# EAGLE schematic schetamic (EAGLE 6.3)
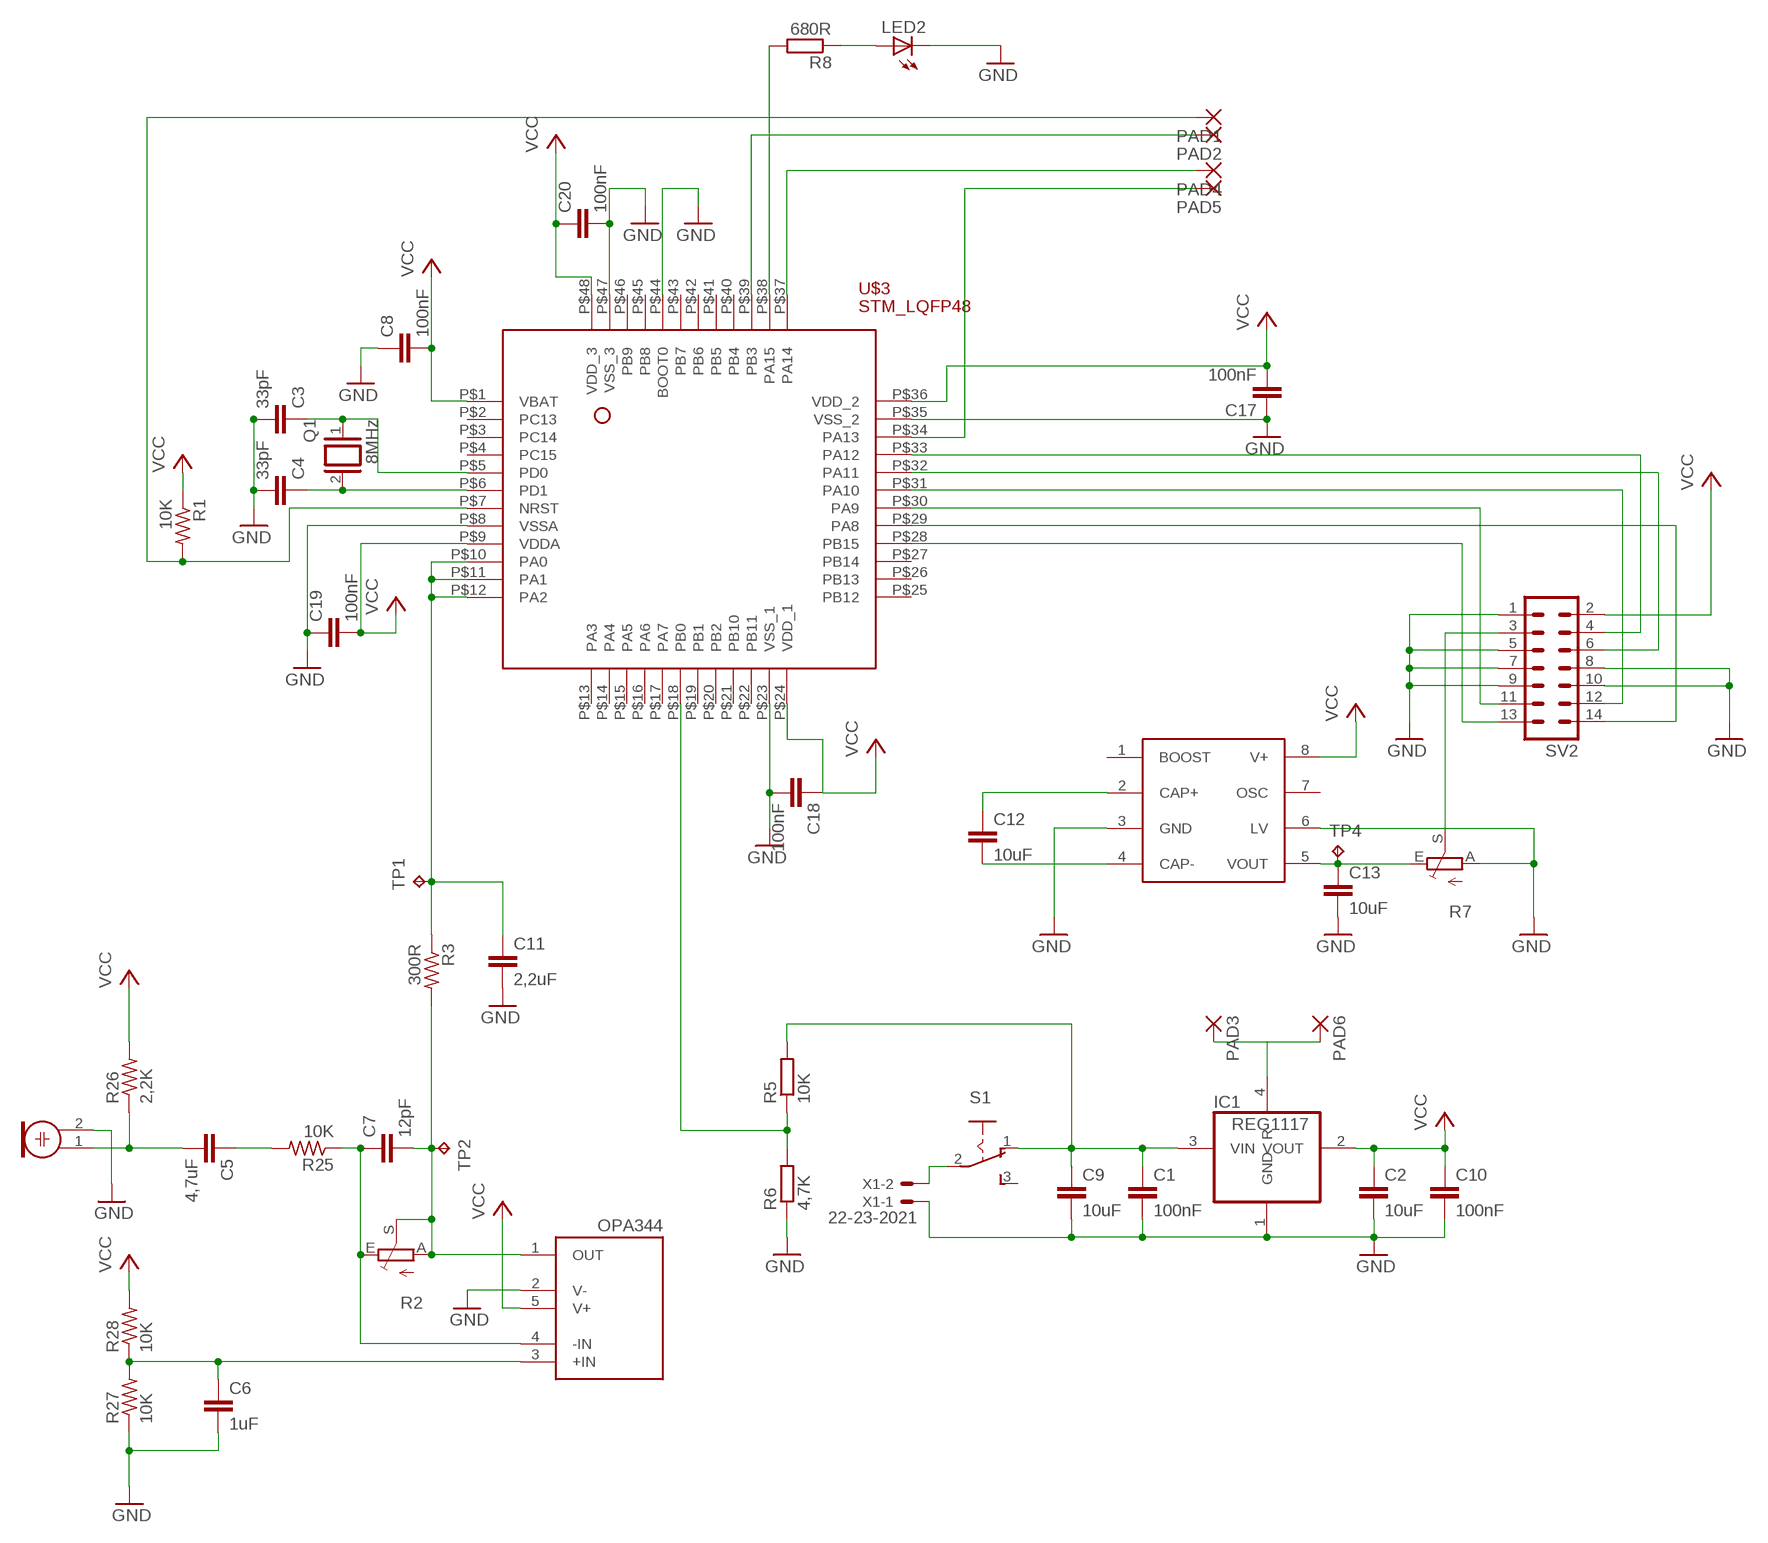
[diagram p0: schematic, sheet 1]

## Parts
C1  100nF  C-EUC1206K  [C1206K]
C2  10uF  C-EUC0805  [C0805]
C3  33pF  C-EUC0805  [C0805]
C4  33pF  C-EUC0805  [C0805]
C5  4,7uF  C-EUC0805  [C0805]
C6  1uF  C-EUC1210  [C1210]
C7  12pF  C-EUC0805  [C0805]
C8  100nF  C-EUC1206K  [C1206K]
C9  10uF  C-EUC0805  [C0805]
C10  100nF  C-EUC1206K  [C1206K]
C11  2,2uF  C-EUC1206K  [C1206K]
C12  10uF  C-EUC0805  [C0805]
C13  10uF  C-EUC0805  [C0805]
C17  100nF  C-EUC1206K  [C1206K]
C18  100nF  C-EUC1206K  [C1206K]
C19  100nF  C-EUC1206K  [C1206K]
C20  100nF  C-EUC1206K  [C1206K]
IC1  REG1117  [SOT223]
LED2  LED3MM  [LED3MM]
M1  ELECTRET_MICROPHON-F6050AP  [F6050AP]
PAD1  SMD2  [SMD1,27-2,54]
PAD2  SMD2  [SMD1,27-2,54]
PAD3  1,6/0,8  [1,6/0,8]
PAD4  SMD2  [SMD1,27-2,54]
PAD5  SMD2  [SMD1,27-2,54]
PAD6  1,6/0,8  [1,6/0,8]
Q1  8MHz  XTAL  [Q]
R1  10K  R-US_R1206  [R1206@1]
R2  TRIM_EU-CA6V  [CA6V]
R3  300R  R-US_R1206  [R1206@1]
R5  10K  R-EU_R1206  [R1206]
R6  4,7K  R-EU_R1206  [R1206]
R7  TRIM_EU-CA6V  [CA6V]
R8  680R  R-EU_M0805  [M0805]
R25  10K  R-US_R1206  [R1206@1]
R26  2,2K  R-US_R1206  [R1206@1]
R27  10K  R-US_R1206  [R1206@1]
R28  10K  R-US_R1206  [R1206@1]
S1  255SB  [255SB]
SV2  MA07-2  [MA07-2]
TP1  TPB1,27  [B1,27]
TP2  TPB1,27  [B1,27]
TP4  TPB1,27  [B1,27]
U$1  ICL7660  [SOIC8]
U$2  OPA344  [SOT23-5]
U$3  STM_LQFP48  [STM_LQFP48]
X1  22-23-2021  [22-23-2021]

## Nets
GND: C1.2 C2.2 C3.2 C4.2 C6.2 C8.1 C9.2 C10.2 C11.2 C13.2 C17.1 C18.2 C19.1 C20.2 IC1.1(GND) LED2.K(C) M1.2 R6.1 R7.A R27.1 SV2.1 SV2.5 SV2.7 SV2.8 SV2.9 SV2.10 U$1.3(GND) U$1.6(LV) U$2.2(V-) U$3.P$8(VSSA) U$3.P$23(VSS_1) U$3.P$35(VSS_2) U$3.P$44(BOOT0) U$3.P$47(VSS_3) X1.1
N$1: C1.1 C9.1 IC1.3(VIN) R5.2 S1.1(O)
N$2: PAD4.1(P) U$3.P$37(PA14)
N$3: C5.1 R25.2
N$4: C3.1 Q1.1 U$3.P$5(PD0)
N$5: C4.1 Q1.2 U$3.P$6(PD1)
N$6: C5.2 M1.1 R26.1
N$7: PAD1.1(P) R1.2 U$3.P$7(NRST)
N$8: R8.2 U$3.P$38(PA15)
N$9: C6.1 R27.2 R28.1 U$2.3(+IN)
N$10: PAD2.1(P) U$3.P$39(PB3)
N$11: PAD5.1(P) U$3.P$34(PA13)
N$12: C7.1 R2.E R25.1 U$2.4(-IN)
N$13: C11.1 R3.1 TP1.TP U$3.P$10(PA0) U$3.P$11(PA1) U$3.P$12(PA2)
N$14: SV2.4 U$3.P$33(PA12)
N$15: SV2.6 U$3.P$32(PA11)
N$16: SV2.11 U$3.P$30(PA9)
N$17: SV2.12 U$3.P$31(PA10)
N$18: SV2.13 U$3.P$28(PB15)
N$19: SV2.14 U$3.P$29(PA8)
N$22: R5.1 R6.2 U$3.P$18(PB0)
N$24: C13.1 R7.E TP4.TP U$1.5(VOUT)
N$25: S1.2(P) X1.2
N$26: R7.S SV2.3
N$27: C12.1 U$1.2(CAP+)
N$28: C12.2 U$1.4(CAP-)
N$33: LED2.A R8.1
PA0: C7.2 R2.A R2.S R3.2 TP2.TP U$2.1(OUT)
RADIATE: IC1.4(R) PAD3.1(P) PAD6.1(P)
VCC: C2.1 C8.2 C10.1 C17.2 C18.1 C19.2 C20.1 IC1.2(VOUT) R1.1 R26.2 R28.2 SV2.2 U$1.8(V+) U$2.5(V+) U$3.P$1(VBAT) U$3.P$9(VDDA) U$3.P$24(VDD_1) U$3.P$36(VDD_2) U$3.P$48(VDD_3)
Unconnected: S1.3(S) U$1.1(BOOST) U$1.7(OSC) U$3.P$2(PC13) U$3.P$3(PC14) U$3.P$4(PC15) U$3.P$13(PA3) U$3.P$14(PA4) U$3.P$15(PA5) U$3.P$16(PA6) U$3.P$17(PA7) U$3.P$19(PB1) U$3.P$20(PB2) U$3.P$21(PB10) U$3.P$22(PB11) U$3.P$25(PB12) U$3.P$26(PB13) U$3.P$27(PB14) U$3.P$40(PB4) U$3.P$41(PB5) U$3.P$42(PB6) U$3.P$43(PB7) U$3.P$45(PB8) U$3.P$46(PB9)

## Library data of the parts
C1-C13 C17-C20 = rcl:C-EU: CAPACITOR, European symbol
IC1 = stm32f4tuner:REG1117: 800mA and 1A Low Dropout (LDO) Positive Regulator 1.8V, 2.5V, 2.85V, 3.3V, 5V, and Adj; MPN: REG1117; OC_FARNELL: 1097566; OC_NEWARK: 14P6981
LED2 = led:LED: LED OSRAM: - CHIPLED LG R971, LG N971, LY N971, LG Q971, LY Q971, LO R971, LY R971 LH N974, LH R974 LS Q976, LO Q976, LY Q976 LO Q996 - Hyper CHIPLED LW Q18S LB Q993, LB Q99A, LB R99A - SideLED LS A670, LO A670, LY A670, LG A670, LP A670 LB A673, LV A673, LT A673, LW A673 LH A674 LY A675 LS A676, LA A676, LO A676, LY A676, LW A676 LS A679, LY A679, LG A679 - Hyper Micro SIDELED® LS Y876, LA Y876, LO Y876, LY Y876 LT Y87S - SmartLED LW L88C, LW L88S LB L89C, LB L89S, LG L890 LS L89K, LO L89K, LY L89K LS L896, LA L896, LO L896, LY L896 - TOPLED LS T670, LO T670, LY T670, LG T670, LP T670 LSG T670, LSP T670, LSY T670, LOP T670, LYG T670 LG T671, LOG T671, LSG T671 LB T673, LV T673, LT T673, LW T673 LH T674 LS T676, LA T676, LO T676, LY T676, LB T676, LH T676, LSB T676, LW T676 LB T67C, LV T67C, LT T67C, LS T67K, LO T67K, LY T67K, LW E67C LS E67B, LA E67B, LO E67B, LY E67B, LB E67C, LV E67C, LT E67C LW T67C LS T679, LY T679, LG T679 LS T770, LO T770, LY T770, LG T770, LP T770 LB T773, LV T773, LT T773, LW T773 LH T774 LS E675, LA E675, LY E675, LS T675 LS T776, LA T776, LO T776, LY T776, LB T776 LHGB T686 LT T68C, LB T68C - Hyper Mini TOPLED® LB M676 - Mini TOPLED Santana® LG M470 LS M47K, LO M47K, LY M47K Source: http://www.osram.convergy.de LUXEON: - LUMILED® LXK2-PW12-R00, LXK2-PW12-S00, LXK2-PW14-U00, LXK2-PW14-V00 LXK2-PM12-R00, LXK2-PM12-S00, LXK2-PM14-U00 LXK2-PE12-Q00, LXK2-PE12-R00, LXK2-PE12-S00, LXK2-PE14-T00, LXK2-PE14-U00 LXK2-PB12-K00, LXK2-PB12-L00, LXK2-PB12-M00, LXK2-PB14-N00, LXK2-PB14-P00, LXK2-PB14-Q00 LXK2-PR12-L00, LXK2-PR12-M00, LXK2-PR14-Q00, LXK2-PR14-R00 LXK2-PD12-Q00, LXK2-PD12-R00, LXK2-PD12-S00 LXK2-PH12-R00, LXK2-PH12-S00 LXK2-PL12-P00, LXK2-PL12-Q00, LXK2-PL12-R00 Source: www.luxeon.com KINGBRIGHT: KA-3528ASYC Source: www.kingbright.com
M1 = microphon:ELECTRET_MICROPHON-: Electret Condenser Microphone
PAD1 PAD2 PAD4 PAD5 = wirepad:SMD2: SMD PAD
PAD3 PAD6 = wirepad:1,6/0,8: THROUGH-HOLE PAD
Q1 = special:XTAL: CRYSTAL
R1 R3 R25-R28 = rcl:R-US_: RESISTOR, American symbol
R2 R7 = pot:TRIM_EU-: POTENTIOMETER
R5 R6 = resistor:R-EU_: RESISTOR, European symbol
R8 = rcl:R-EU_: RESISTOR, European symbol
S1 = stm32f4tuner:255SB: SLIDING SWITCH Distributor Buerklin, 11G810
SV2 = con-lstb:MA07-2: PIN HEADER; OC_FARNELL: unknown; OC_NEWARK: unknown
TP1 TP2 TP4 = testpad:TP: Test pad
U$1 = stm32f4tuner:ICL7660
U$2 = stm32f4tuner:OPA344
U$3 = stm32f4tuner:STM_LQFP48
X1 = con-molex:22-23-2021: .100" (2.54mm) Center Header - 2 Pin; MF: MOLEX; MPN: 22-23-2021; OC_FARNELL: 1462926; OC_NEWARK: 25C3832